# Altium project st7789 + esp32 + nrf24.PrjPcb
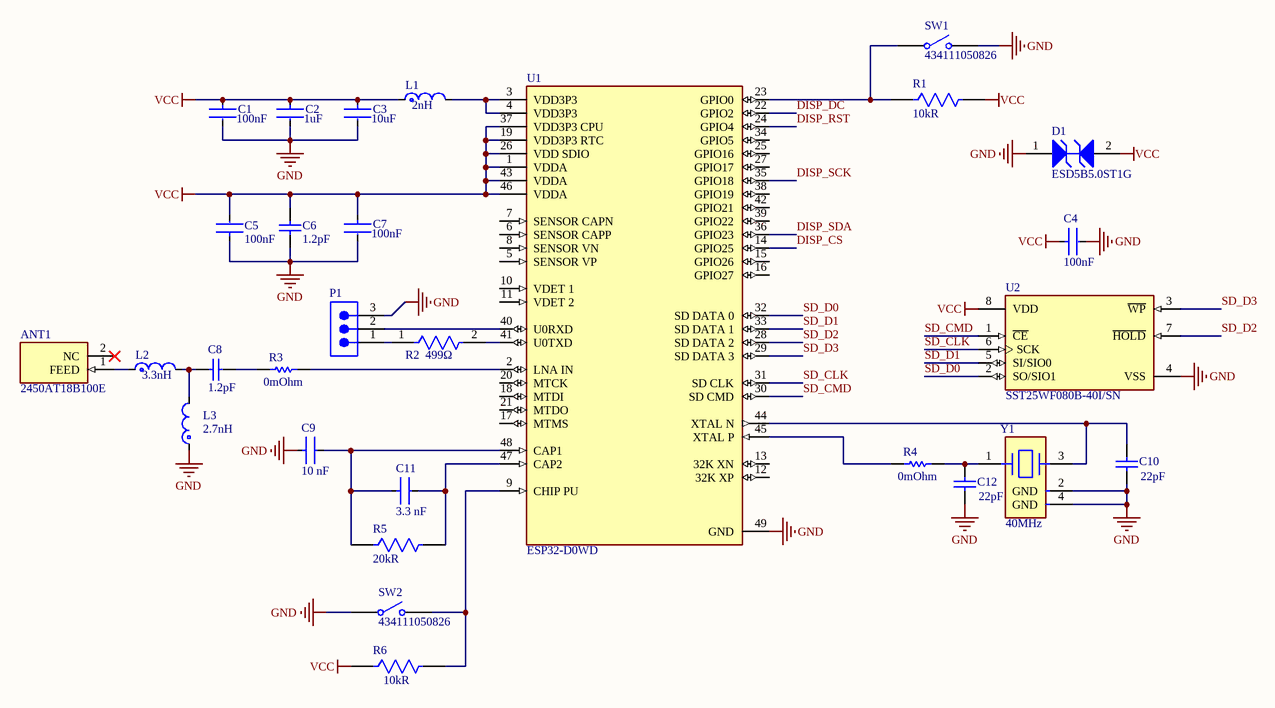
[diagram p0: esp32.SchDoc]
2 sheets, 56 parts. Net scope: global (net labels, ports and power ports of the same name join across sheets).
Board file: main.PcbDoc
Sheets:
  esp32.SchDoc
  power + display.SchDoc

## Sheet esp32.SchDoc
size A4; SheetNumber: 1; SheetTotal: 2

### Parts
ANT1  2450AT18B100E  [ANTC3216X140N]
C1  Capacitance: 100nF  [FP-CGA3E-0_3-0_1-IPC_A]  (hidden comment: CGA3E2X7R1H104K080AA)
C2  Capacitance: 1uF  [FP-0603-L_1_6_0_15-W_0_8-IPC_C]  (hidden comment: UMK107AB7105KA-T)
C3  Capacitance: 10uF  [FP-C1608-080-0_1-MFG]  (hidden comment: C1608X5R1A106K080AC)
C4  Capacitance: 100nF  [FP-CGA3E-0_3-0_1-IPC_A]  (hidden comment: CGA3E2X7R1H104K080AA)
C5  Capacitance: 100nF  [FP-CGA3E-0_3-0_1-IPC_A]  (hidden comment: CGA3E2X7R1H104K080AA)
C6  1.2pF  [CAPC1608X90X35NL10T15]
C7  Capacitance: 100nF  [FP-CGA3E-0_3-0_1-IPC_A]  (hidden comment: CGA3E2X7R1H104K080AA)
C8  1.2pF  [CAPC1608X90X35NL10T15]
C9  Capacitance: 10 nF  [FP-CC0603-DA-MFG]  (hidden comment: CC0603KRX7R9BB103)
C10  Capacitance: 22pF  [CAPC1608X90X35ML10T15]  (hidden comment: GRM1885C1H220JA01D)
C11  value 3.3 nF  [FP-C0603C-CF-MFG]  (hidden comment: C0603C332J5GACTU)
C12  Capacitance: 22pF  [CAPC1608X90X35ML10T15]  (hidden comment: GRM1885C1H220JA01D)
D1  ESD5B5.0ST1G  [ONSC-SOD-523-2-502-01_C_V]
L1  Inductance: 2nH  [FP-LQP03TG_02-IPC_A]  (hidden comment: LQP03TN2N0B02D)
L2  Inductance: 3.3nH  [FP-LQG18HH_00-MFG]  (hidden comment: LQG18HN3N3S00D)
L3  Inductance: 2.7nH  [FP-LQG18HH_00-MFG]  (hidden comment: LQG18HN2N7S00D)
P1  61900319521  [61900319521]  (value not drawn)
R1  Resistance: 10kR  [FP-RC0603-0_55-IPC_C]  (hidden comment: RC0603FR-0710KL)
R2  Resistance: 499Ω  [FP-RT0603-MFG]  (hidden comment: RT0603DRE07499RL)
R3  Resistance: 0mOhm  [RESC1608X55X25ML10T15]  (hidden comment: RC0603JR-070RL)
R4  Resistance: 0mOhm  [RESC1608X55X25ML10T15]  (hidden comment: RC0603JR-070RL)
R5  Resistance: 20kR  [FP-RC0603-0_55-IPC_C]  (hidden comment: RC0603FR-0720KL)
R6  Resistance: 10kR  [FP-RC0603-0_55-IPC_C]  (hidden comment: RC0603FR-0710KL)
SW1  434111050826  [WS-TASV_L6W3.5H5_4341x10508x6]
SW2  434111050826  [WS-TASV_L6W3.5H5_4341x10508x6]
U1  ESP32-D0WD  [FP-ESP32-D0WD-IPC_C]
U2  SST25WF080B-40I/SN  [FP-C04-057-SN-MFG]
Y1  Frequency: 40MHz  [FP-7M-MFG]  (hidden comment: 7M-40.000MEEQ-T)

### Nets
GND: C1.2 C2.2 C3.1 C4.2 C5.1 C6.1 C7.2 C9.1 C10.1 C12.1 D1.1(A1) L3.1 P1.3 SW1.2 SW2.1 U1.49(GND) U2.4(VSS) Y1.2(GND) Y1.4(GND)
VCC: C1.1 C2.1 C3.2 C4.1 C5.2 C6.2 C7.1 D1.2(A2) L1.1 R1.2 R6.1 U1.1(VDDA) U1.19(VDD3P3_RTC) U1.26(VDD_SDIO) U1.37(VDD3P3_CPU) U1.43(VDDA) U1.46(VDDA) U2.8(VDD)
DISP_CS: U1.14(GPIO25)
DISP_DC: U1.22(GPIO2)
DISP_RST: U1.24(GPIO4)
DISP_SCK: U1.35(GPIO18)
DISP_SDA: U1.36(GPIO23)
SD_CLK: U1.31(SD_CLK) U2.6(SCK)
SD_CMD: U1.30(SD_CMD) U2.1(~{CE})
SD_D0: U1.32(SD_DATA_0) U2.2(SO/SIO1)
SD_D1: U1.33(SD_DATA_1) U2.5(SI/SIO0)
SD_D2: U1.28(SD_DATA_2) U2.7(~{HOLD})
SD_D3: U1.29(SD_DATA_3) U2.3(~{WP})
NetANT1_1: ANT1.1(FEED) L2.1
NetC8_1: C8.1 L2.2 L3.2
NetC8_2: C8.2 R3.1
NetC9_2: C9.2 C11.1 R5.1 U1.48(CAP1)
NetC10_2: C10.2 U1.44(XTAL_N) Y1.3
NetC11_2: C11.2 R5.2 U1.47(CAP2)
NetC12_2: C12.2 R4.2 Y1.1
NetL1_2: L1.2 U1.3(VDD3P3) U1.4(VDD3P3)
NetP1_1: P1.1 R2.1
NetP1_2: P1.2 U1.40(U0RXD)
NetR1_1: R1.1 SW1.1 U1.23(GPIO0)
NetR2_2: R2.2 U1.41(U0TXD)
NetR3_2: R3.2 U1.2(LNA_IN)
NetR4_1: R4.1 U1.45(XTAL_P)
NetR6_2: R6.2 SW2.2 U1.9(CHIP_PU)

Not connected (* = marked no-connect by the designer): ANT1 2(NC)*; U1 5(SENSOR_VP) 6(SENSOR_CAPP) 7(SENSOR_CAPN) 8(SENSOR_VN) 10(VDET_1) 11(VDET_2) 12(32K_XP) 13(32K_XN) 15(GPIO26) 16(GPIO27) 17(MTMS) 18(MTDI) 20(MTCK) 21(MTDO) 25(GPIO16) 27(GPIO17) 34(GPIO5) 38(GPIO19) 39(GPIO22) 42(GPIO21)

### Library data of the parts
ANT1 = 2450AT18B100E: Antenna Chip -0.5dBi Gain 2500MHz 2-Pin CSMD T/R; MF: Johanson; SnapEDA_Link: https://www.snapeda.com/parts/2450AT18B100E/AN/view-part/?ref=snap; Package: None; Value: *; MP: 2450AT18B100E; Check_prices: https://www.snapeda.com/parts/2450AT18B100E/AN/view-part/?ref=eda
C1 C4 C5 C7 = CMP-2000-07546-2: Cap Ceramic 100nF 50V X7R 10% Pad SMD 0603 +125°C Automotive T/R; Weight: 7.1E-05oz; Composition: Ceramic; Max Operating Temperature: 125°C; Termination: SMD/SMT; Dielectric: X7R; Length: 1.6mm; Package Quantity: 1; REACH SVHC: No SVHC; Lead Free: Lead Free; Case Code (Metric): 1608; Min Operating Temperature: -55°C; Packaging: Tape and Reel; Tolerance: 10%; Voltage Rating: 50V; Case Code (Imperial): 0603; Case/Package: 0603; Voltage Rating (DC): 50V; Depth: 0.8mm; Radiation Hardening: No; Ratings: AEC-Q200; Mount: Surface Mount; Voltage: 50V; Thickness: 0.035inch; Width: 0.8mm; Height: 0.8mm
C2 = CMP-2000-07531-4: Ceramic Capacitor General Use 1uF ±10% 50V X7R 0603; Series: M; Width: 0.031inch; Mount: Surface Mount; Radiation Hardening: No; Voltage Rating (DC): 50V; Packaging: Tape and Reel; Termination: SMD/SMT; Depth: 0.8mm; Case Code (Metric): 1608; Case Code (Imperial): 0603; Height: 0.8mm; Voltage Rating: 50V; Package Quantity: 1; Halogen Free: Halogen Free; Dielectric: X7R; Min Operating Temperature: -55°C; Length: 1.6mm; Construction: Flat; Tolerance: 10%; Thickness: 0.037inch; Max Operating Temperature: 125°C; Case/Package: 0603; RoHS Compliant: Yes
C3 = CMP-2000-04979-3: Multilayer Ceramic Capacitors 10μF ±10% 10V X5R SMD 0603; Dielectric Material: Ceramic; Construction: Flat; Height: 0.8mm; Thickness: 0.035inch; Case Code (Metric): 1608; Radiation Hardening: No; Number of Pins: 2; Voltage Rating (DC): 10V; Depth: 0.8mm; Voltage: 10V; RoHS Compliant: Yes; Voltage Rating: 10V; Package Quantity: 1; Resistor Type: Ceramic; Termination: SMD/SMT; Lead Free: Lead Free; REACH SVHC: No SVHC; Tolerance: 10%; Mount: Surface Mount; Series: C; Packaging: Tape and Reel; Width: 0.8mm; Dielectric: X5R; Weight: 7.1E-05oz; Length: 1.6mm; Max Operating Temperature: 85°C; Case Code (Imperial): 0603; Case/Package: 0603; Min Operating Temperature: -55°C
C6 C8 = CMP-2006-02438-1: Manufacturer: Murata; Part Number: GQM1885C2A1R2CB01D
C9 = CMP-2100-03600-2: CAP CER 10000PF 50V X7R 0603; Manufacturer: YAGEO; Tolerance: 0.1; Material: Ceramic; Temperature Coefficient: 15%; Value: 10 nF; Mouser Description: Multilayer Ceramic Capacitor, CC Series, 0.01 - F, - 10%, X7R, 50 V, 0603 [1608 Metric]; Digikey Description: CAP CER 10000PF 50V X7R 0603; Height: 0.9mm; Category: Cap; Temperature Characteristic: X7R; Footprint Url: http://www.yageo.com/exep/pages/download/literatures/UPY-C_GEN_24.pdf; Lead Free: Yes; Voltage Rating: 50 V; Manufacturer Part Number: CC0603KRX7R9BB103; Temperature: -55°C to +125°C; Device Class L3: Ceramic Capacitors; ComponentLink2Description: Datasheet; Voltage: 50 V; Package: CC0603-DA; Octopart: https://octopart.com/cc0603krx7r9bb103-yageo-192938; Automotive: No; Temperature Range High: +125°C; Temperature Range Low: -55°C; RoHS: TRUE; Device Class L1: Passive Components; ComponentLink2URL: http://www.yageo.com/documents/recent/UPY-GPHC_X7R_6.3V-to-50V_18.pdf; Device Class L2: Capacitors
C10 C12 = CMP-2000-04945-1: Chip Capacitor, 22 pF, +/- 5%, 50 V, -55 to 125 degC, 0603 (1608 Metric), RoHS, Tape and Reel; Manufacturer: Murata; Rated Voltage: 50V; Dielectric: C0G; Manufacturer URL: http://www.murata.com/; Datasheet Version: Jul-06; Package Reference: 603; Tolerance (%): ±5%; Case Size/Dimension: 0603; Package Description: 2-Pin Surface Mount Device, Body 1.6 x 0.8 mm; Datasheet URL: https://datasheet.ciiva.com/11786/0900766b807a1cab-11786398.pdf
C11 = CMP-2006-03334-2: CAP CER 3300PF 50V 5% NP0 0603; Manufacturer: KEMET; Temperature Characteristic: C0G; Temperature Coefficient: 30ppm/°C; Tolerance: 0.05; Automotive Grade: Grade 1; Material: Ceramic; Capacitance: 3,300 pF; Category: Cap; Digikey Description: CAP CER 3300PF 50V 5% NP0 0603; Temperature Range Low: -55°C; Mouser Description: Multilayer Ceramic Capacitors MLCC - SMD/SMT 50volts 3300pF 5% C0G; Device Class L2: Capacitors; Octopart: https://octopart.com/c0603c332j5gactu-kemet-12580539; Package: C0603C-CF; Lead Free: Yes; Temperature Range High: +125°C; Automotive: Yes; ComponentLink2URL: https://api.kemet.com/component-edge/download/datasheet/C0603C100J5GACAUTO.pdf; Voltage Rating: 50 V; Device Class L3: Ceramic Capacitors; Temperature: -55°C to +125°C; ComponentLink2Description: Datasheet; Device Class L1: Passive Components; Manufacturer Part Number: C0603C332J5GACTU; Height: 0.87mm; RoHS: TRUE
D1 = CMP-1063-00096-1: Transient Voltage Suppressor, Micro-Packaged Diode for ESD Protection, 2-Pin SOD-523, Pb-Free, Tape and Reel; Manufacturer: On Semiconductor; Number of Lines: 1; Direction: Bidirectional; VRWM Max (V): 5; V(BR) Min (V): 5.8; ComponentLink2URL: http://www.onsemi.cn/pub_link/Collateral/ESD5B5.0ST1G.PDF; Mounting Technology: Surface Mount; ComponentLink1URL: http://www.onsemi.com/; ComponentLink2Description: Datasheet; ComponentLink3Description: Package Specification; RoHS: Pb-Free; Packing: Tape and Reel; PackageDescription: 2-Pin SOD, Body 1.2 x 0.8 mm; ComponentLink1Description: Manufacturer URL; ComponentLink3URL: http://www.onsemi.cn/pub_link/Collateral/ESD5B5.0ST1G.PDF; PackageVersion: Rev. C, 03/2007; DatasheetVersion: Rev. 3; PartNumber: ESD5B5.0ST1G; PackageReference: SOD-523-2-502-01_C; IR Max (uA): 1
L1 = CMP-06042-013297-1: Film type RF Inductor 2nH ±0.1nH 600mA 0.15Ω 0201 (0603); Current: 400mA; DC Resistance (DCR): 150mR; Core Material: Non-Magnetic; Q Factor: 14; Shielding: Unshielded; Self Resonant Frequency: 12.5GHz; Test Frequency: 500MHz; Height - Seated (Max): 0.013inch; Case/Package: 0201; Depth: 0.33mm; Width: 0.012inch; Mount: Surface Mount; Case Code (Imperial): 0201; Packaging: Tape and Reel; Max DC Current: 600mA; Resistor Type: Thin Film; Case Code (Metric): 0603; Length: 0.6mm; Termination: SMD/SMT; Max Operating Temperature: 125°C; REACH SVHC: No SVHC; DC Current: 600mA; Package Quantity: 15000; Height: 0.3mm; Military Standard: Not; Min Operating Temperature: -55°C; Current Rating: 600mA
L2 = CMP-06042-009861-1: Multilayer type RF Inductor 3.3nH ±0.3nH 0.12Ω 1000mA 0603; Max DC Current: 500mA; Q Factor: 12; DC Resistance (DCR): 150mR; Test Frequency: 100MHz; Self Resonant Frequency: 6GHz; Shielding: Unshielded; Core Material: Air; Case/Package: 0603; DC Current: 500mA; Case Code (Metric): 1608; Package Quantity: 4000; Depth: 0.95mm; Max Operating Temperature: 85°C; Height - Seated (Max): 0.037inch; Mount: Surface Mount; REACH SVHC: No SVHC; Length: 1.6mm; Min Operating Temperature: -55°C; Military Standard: Not; Lead Free: Lead Free; Width: 0.8mm; Packaging: Tape and Reel; Height: 0.8mm; Termination: SMD/SMT; Current Rating: 500mA; Case Code (Imperial): 0603; Radiation Hardening: No
L3 = CMP-06042-013926-1: Multilayer type RF Inductor 2.7nH ±0.3nH 0.12Ω 1000mA 0603; Current Rating: 500mA; DC Resistance (DCR): 150mR; Q Factor: 12; Self Resonant Frequency: 6GHz; Test Frequency: 100MHz; Shielding: Unshielded; Core Material: Air; Mount: Surface Mount; Lead Free: Lead Free; Length: 1.75mm; Case Code (Imperial): 0603; Military Standard: Not; Case Code (Metric): 1608; Max DC Current: 500mA; Min Operating Temperature: -55°C; Depth: 0.95mm; REACH SVHC: No SVHC; Termination: SMD/SMT; Package Quantity: 4000; Number of Pins: 2; Max Operating Temperature: 85°C; Height: 0.8mm; Case/Package: 0603; Width: 0.8mm; Packaging: Tape and Reel; Height - Seated (Max): 0.037inch; DC Current: 500mA; Radiation Hardening: No
P1 = CMP-1502-00600-2: NexarPartId: 18818224; Connector Type: Male Pin; Contact Resistance: 20mΩ; Pitch: 2.54mm; Insulation Resistance: 1GΩ; Number of Contacts: 3; Insulation: Insulated; Gender: Male; Operating Supply Voltage: 250V; Current Rating: 3A; Number of Pins: 3; Min Operating Temperature: -40°C; Color: Beige; Contact Gender: Male; RoHS: Compliant; Max Operating Temperature: 105°C; Height: 3.3mm; Length: 7.62mm; Packaging: Bulk; Width: 7.62mm; Contact Plating: Tin; Lead Pitch: 2.54mm; Number of Rows: 1; Lead Free: Lead Free; Mount: Through Hole; Termination: Through Hole; REACH SVHC: Unknown; Number of Positions: 3; Contact Material: Copper; Contact Mating Length: 7.493mm; Flammability Rating: UL94 V-0; Housing Material: Nylon; Voltage Rating: 250V; Fastening Type: Friction
R1 R6 = CMP-2100-03664-2: RES 10K OHM 1% 1/10W 0603; Voltage Rating: 75V; Voltage Rating (DC): 50V; Power Rating: 100mW; Temperature Coefficient: 100ppm/°C; Depth: 0.8mm; Termination: SMD/SMT; Resistor Type: Thick Film; Series: RC; Construction: Rectangular; Features: Moisture Resistant; Packaging: Tape and Reel; Min Operating Temperature: -55°C; Number of Terminations: 2; Lead Pitch: 0.3mm; RoHS Compliant: Yes; Case/Package: 0603; Resistance Tolerance: 1%; Military Standard: Not; Weight: 7.1E-05oz; Number of Pins: 2; Tolerance: 1%; Length: 1.6mm; Case Code (Imperial): 0603; Lead Free: Lead Free; Width: 0.8mm; Max Power Dissipation: 100mW; Height: 0.45mm; Max Operating Temperature: 155°C; Case Code (Metric): 1608; Size Code: 0603
R2 = CMP-03412-013051-1: RES 499 OHM 1/10W .5% SMD 0603; Manufacturer: Yageo; Tolerance: 0.005; Temperature Coefficient: 50 ppm/°C; Voltage Rating: 75V; Power Rating: 0.1W; Value: 499Ω; Temperature Range High: +155°C; ComponentLink2URL: http://www.yageo.com/documents/recent/PYu-RT_1-to-0.01_RoHS_L_9.pdf; Device Class L3: Chip SMD Resistors; Digikey Description: RES 499 OHM 1/10W .5% SMD 0603; Height: 0.55mm; Category: Res; Temperature Range Low: -55°C; Manufacturer Part Number: RT0603DRE07499RL; Footprint Url: http://www.yageo.com/exep/pages/download/literatures/PYu-R_Mount_10.pdf; Device Class L1: Passive Components; Temperature: -55°C to +155°C; ComponentLink2Description: Datasheet; Ipc Land Pattern Name: RESC16080X45; RoHS: TRUE; Composition: Thin Film; Package: RT0603; Lead Free: Yes; Device Class L2: Resistors; Automotive: No; Octopart: https://octopart.com/rt0603dre07499rl-yageo-1226881; Series: RT
R3 R4 = CMP-2100-03667-1: Chip Resistor, 0 Ohm, +/- 5%, 0.1 W, -55 to 155 degC, 0603 (1608 Metric), RoHS, Tape and Reel; Manufacturer: Yageo; Temperature Coefficient: 200ppm/degreesC; Voltage Rating: 50V; Power Rating: 100mW; Width: 0.8mm; Max Operating Temperature: 155degC; Tolerance: 5%; Package Reference: 0603; Height: 0.45mm; Depth: 0.8mm; Package Description: 2-Pin Surface Mount Device, Body 1.6 x 0.8 mm; Termination: SMD/SMT; Package Quantity: 5000; Case/Package: 0603; Case Code (Imperial): 0603; Radiation Hardening: No; Number of Pins: 2; Length: 1.6mm; Lead Free: LeadFree; Voltage Rating (DC): 50V; Military Standard: Not; Datasheet URL: http://www.yageo.com/NewPortal/yageodocoutput?fileName=/pdf/R-Chip/PYu-RC_Group_51_RoHS_L_5.pdf; Manufacturer URL: http://www.yageo.com/; Packaging: TapeandReel; Case Code (Metric): 1608; Min Operating Temperature: -55degC; Composition: ThickFilm; RoHSCompliant: true; Contact Plating: Tin; Datasheet Version: Rev. 5, 10/2016; REACH SVHC: NoSVHC
R5 = CMP-2000-06932-2: RES 20K OHM 1% 1/10W 0603; Voltage Rating: 50V; Temperature Coefficient: 100ppm/°C; Power Rating: 100mW; Height: 0.022inch; REACH SVHC: No SVHC; Case Code (Metric): 1608; Depth: 0.8mm; Tolerance: 1%; Min Operating Temperature: -55°C; Series: RC; RoHS Compliant: Yes; Resistor Type: Thick Film; Max Power Dissipation: 100mW; Features: Moisture Resistant; Max Operating Temperature: 155°C; Package Quantity: 1; Size Code: 0603; Packaging: Tape and Reel; Width: 0.031inch; Length: 0.063inch; Military Standard: Not; Technology: THICK FILM; Number of Terminations: 2; Termination: SMD/SMT; Construction: Rectangular; Case/Package: 0603; Number of Pins: 2; Lead Free: Lead Free; Voltage Rating (DC): 50V; Resistance Tolerance: 1%; Case Code (Imperial): 0603
SW1 SW2 = CMP-1459-00003-2: NexarPartId: 23272333; Throw Configuration: SPST; Illumination Type: Illuminated, Non-Illuminated; Voltage Rating: 12V; Switch Travel: 250µm; Switch Function: Off-Mom; Mechanical Life: 30kcycles; Operating Force: 260N; Contact Current Rating: 50mA; Actuator Material: Liquid Crystal Polymer, Polymer; Contact Resistance: 100mΩ; Actuator Length: 1.5mm; Termination: SMD/SMT; Contact Material: Stainless Steel, Steel; Max Operating Temperature: 85°C; REACH SVHC: No SVHC; Length: 8mm; Packaging: Tape and Reel; Min Operating Temperature: -40°C; RoHS: Compliant; Width: 3.5mm; Mount: Surface Mount; Current Rating: 50mA; Contact Plating: Silver; Height: 5mm; Insulation Resistance: 100MΩ
U1 = CMP-194065-000002-1: IC RF TXRX+MCU BLUETOOTH 48VFQFN; Manufacturer: Espressif; Max Frequency: 2484MHz; Max Supply Voltage: 3.6V; Interface: I2C,SPI,UART,CAN,Ethernet,I2S,Other; Receiving Current: 100mA; Min Supply Voltage: 1.8V; Data Rate: 150Mbits/s; Number Of Gpio: 34; Bandwidth: 2412-2484MHz; Nominal Supply Current: 0.5A; Sensitivity: -70dBm; Number Of Adc Channels: 18; Transmitting Current: 240mA; Standoff Height: 0mm; Manufacturer Part Number: ESP32-D0WD; Device Class L3: Transceivers; Ipc Land Pattern Name: QFN35P500X500X85-48; Category: IC; Device Class L2: RF Semiconductors and Devices; Device Class L1: Integrated Circuits (ICs); Digikey Description: IC RF TXRX+MCU BLUETOOTH 48VFQFN; ComponentLink2URL: https://www.espressif.com/sites/default/files/documentation/esp32_datasheet_en.pdf; Temperature Range Low: -40°C; Mouser Description: SMD IC ESP32-D0WD, Dual Core Mcu, Wifi & Bluetooth Combo, QFN48-PIN, 5*5MM; Height: 0.9mm; Octopart: https://octopart.com/esp32-d0wd-espressif+systems-89169964; Automotive: No; ComponentLink2Description: Datasheet; Temperature: -40°C to +125°C; Lead Free: Yes; Temperature Range High: +125°C; RoHS: TRUE; Package: ESP32-D0WD
U2 = CMP-06315-000020-1: IC FLASH 8MBIT SPI 40MHZ 8SOIC; Min Supply Voltage: 1.65V; Nominal Supply Current: 4mA; Density: 8Mb; Page Size: 256B; Operating Supply Voltage: 1.8V; Max Supply Voltage: 1.95V; Min Operating Temperature: -40°C; Frequency: 40MHz; Mount: Surface Mount; Memory Type: FLASH; Packaging: Rail/Tube; Interface: SPI; Memory Size: 8Mb; Max Operating Temperature: 85°C; Number of Pins: 8; Case/Package: SOIC; Supply Current: 4mA; Height: 1.5mm; RoHS Compliant: Yes; Series: SST25; REACH SVHC: No SVHC; Contact Plating: Tin; Radiation Hardening: No; Max Frequency: 40MHz; Length: 4.9mm; Width: 3.9mm
Y1 = CMP-18717-000452-1: Crystal 40MHz, 10ppm, 10pF, 50Ω; ESR (Equivalent Series Resistance): 60R; Lead Free: Lead Free; Frequency Tolerance: 10ppm; Width: 2.5mm; Depth: 2.5mm; Frequency Stability: 10ppm; Length: 0.126inch; Height: 0.031inch; Max Operating Temperature: 70°C; Load Capacitance: 10pF; Packaging: Tape and Reel; Series: 7M; Min Operating Temperature: -10°C; Mount: Surface Mount; Package Quantity: 1; REACH SVHC: No SVHC; Termination: SMD/SMT; Case/Package: SMD/SMT; Tolerance: 10ppm

## Sheet power + display.SchDoc
size A4; SheetNumber: 2; SheetTotal: 2
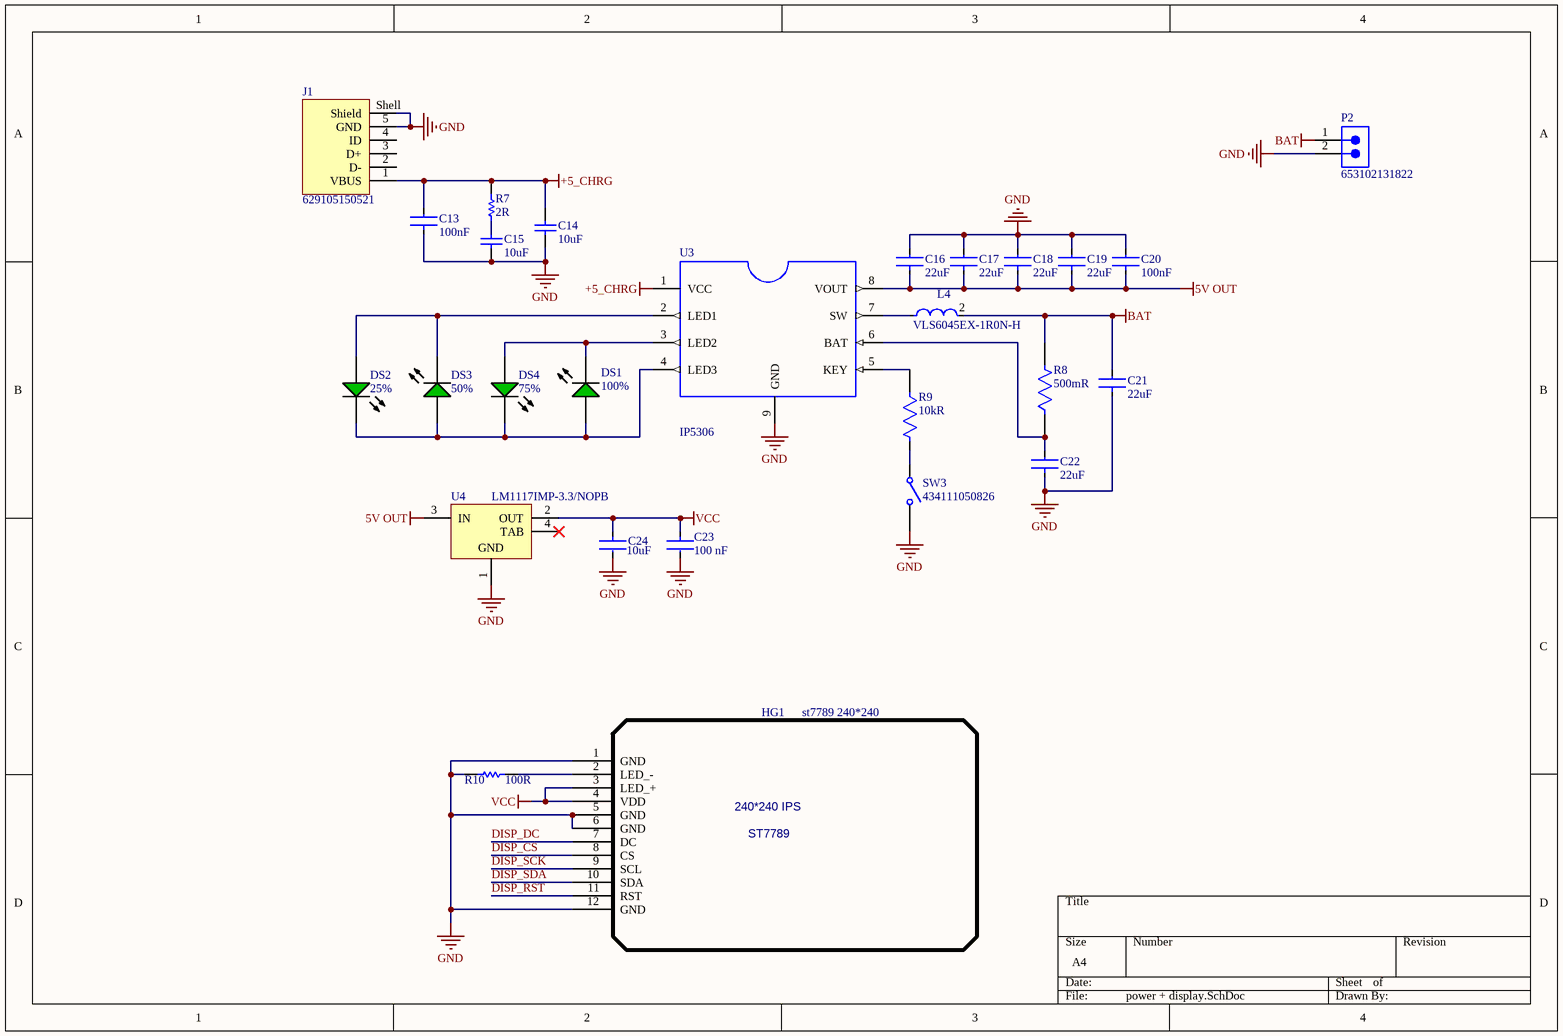
[diagram p1: power + display.SchDoc]

### Parts
C13  Capacitance: 100nF  [FP-CGA3E-0_3-0_1-IPC_A]  (hidden comment: CGA3E2X7R1H104K080AA)
C14  10uF  [CAPC2013X140X45NL15T25]
C15  10uF  [CAPC2013X140X45NL15T25]
C16  Capacitance: 22uF  [FP-1206-L_3_2_0_2-W_1_6_0-IPC_A]  (hidden comment: 12066C226KAT2A)
C17  Capacitance: 22uF  [FP-1206-L_3_2_0_2-W_1_6_0-IPC_A]  (hidden comment: 12066C226KAT2A)
C18  Capacitance: 22uF  [FP-1206-L_3_2_0_2-W_1_6_0-IPC_A]  (hidden comment: 12066C226KAT2A)
C19  Capacitance: 22uF  [FP-1206-L_3_2_0_2-W_1_6_0-IPC_A]  (hidden comment: 12066C226KAT2A)
C20  Capacitance: 100nF  [FP-CGA3E-0_3-0_1-IPC_A]  (hidden comment: CGA3E2X7R1H104K080AA)
C21  Capacitance: 22uF  [FP-1206-L_3_2_0_2-W_1_6_0-IPC_A]  (hidden comment: 12066C226KAT2A)
C22  Capacitance: 22uF  [FP-1206-L_3_2_0_2-W_1_6_0-IPC_A]  (hidden comment: 12066C226KAT2A)
C23  value 100 nF  [FP-CC0402-MFG]  (hidden comment: CC0402KRX7R9BB104)
C24  Capacitance: 10uF  [FP-C1608-080-0_1-MFG]  (hidden comment: C1608X5R1A106K080AC)
DS1  100%  [AVAG-HSMX-C170_V]
DS2  25%  [AVAG-HSMX-C170_V]
DS3  50%  [AVAG-HSMX-C170_V]
DS4  75%  [AVAG-HSMX-C170_V]
HG1  st7789 240*240  [PCBComponent_1]
J1  629105150521  [629105150521]
L4  VLS6045EX-1R0N-H  [FP-VLS6045EX-H-MFG]
P2  653102131822  [653102131822]
R7  2R  [RESC2013X60X30ML20T20]
R8  500mR  [FP-CSR0603-IPC_B]
R9  Resistance: 10kR  [FP-MCT0603-IPC_C]  (hidden comment: MCT06030C1002FP500)
R10  100R  [RESC1609X50X30LL10T20]
SW3  434111050826  [WS-TASV_L6W3.5H5_4341x10508x6]
U3  IP5306  [SOIC9P127_490X600X170L84X42T330X241N]
U4  LM1117IMP-3.3/NOPB  [DCY0004A_N]

### Nets
5V OUT: C16.1 C17.1 C18.1 C19.1 C20.1 U3.8(VOUT) U4.3(IN)
+5_CHRG: C13.2 C14.2 J1.1(VBUS) R7.2 U3.1(VCC)
BAT: C21.2 L4.2 P2.1 R8.2
GND: C13.1 C14.1 C15.1 C16.2 C17.2 C18.2 C19.2 C20.2 C21.1 C22.1 C23.2 C24.1 HG1.1(GND) HG1.5(GND) HG1.6(GND) HG1.12(GND) J1.5(GND) J1.Shell(Shield) P2.2 R10.1 SW3.2 U3.9(GND) U4.1(GND)
VCC: C23.1 C24.2 HG1.3(LED_+) HG1.4(VDD) U4.2(OUT)
DISP_CS: HG1.8(CS)
DISP_DC: HG1.7(DC)
DISP_RST: HG1.11(RST)
DISP_SCK: HG1.9(SCL)
DISP_SDA: HG1.10(SDA)
NetC15_2: C15.2 R7.1
NetC22_2: C22.2 R8.1 U3.6(BAT)
NetDS1_1: DS1.1(A) DS2.2(K) DS3.1(A) DS4.2(K) U3.4(LED3)
NetDS1_2: DS1.2(K) DS4.1(A) U3.3(LED2)
NetDS2_1: DS2.1(A) DS3.2(K) U3.2(LED1)
NetHG1_2: HG1.2(LED_-) R10.2
NetL4_1: L4.1 U3.7(SW)
NetR9_1: R9.1 U3.5(KEY)
NetR9_2: R9.2 SW3.1

Not connected (* = marked no-connect by the designer): J1 2(D-) 3(D+) 4(ID); U4 4(TAB)*

### Notes on the sheet
- (in symbol st7789 240*240) 240*240 IPS; ST7789

### Library data of the parts
C13 C20 = CMP-2000-07546-2: as C1 on sheet esp32; Weight: 7.1E-05oz; Composition: Ceramic; Max Operating Temperature: 125°C; Termination: SMD/SMT; Dielectric: X7R; Length: 1.6mm; Package Quantity: 1; REACH SVHC: No SVHC; Lead Free: Lead Free; Case Code (Metric): 1608; Min Operating Temperature: -55°C; Packaging: Tape and Reel; Tolerance: 10%; Voltage Rating: 50V; Case Code (Imperial): 0603; Case/Package: 0603; Voltage Rating (DC): 50V; Depth: 0.8mm; Radiation Hardening: No; Ratings: AEC-Q200; Mount: Surface Mount; Voltage: 50V; Thickness: 0.035inch; Width: 0.8mm; Height: 0.8mm
C14 C15 = CMP-2007-03395-1: Part Number: GRM21BR71A106KE51L; Manufacturer: Murata
C16-C19 C21 C22 = CMP-1037-04985-3: CAP CER 22UF 6.3V X7R 1206; Tolerance: 10%; Dissipation Factor: 5%; Thickness: 0.07inch; Min Operating Temperature: -55°C; Width: 1.6mm; Case Code (Metric): 3216; Construction: Flat; Max Operating Temperature: 125°C; Case/Package: 1206; Case Code (Imperial): 1206; Lead Free: Lead Free; REACH SVHC: No SVHC; Voltage Rating (DC): 6.3V; Number of Pins: 2; Contact Plating: Tin; Dielectric: X7R; Radiation Hardening: No; Depth: 1.6mm; Series: FlEXITERM; Mount: Surface Mount; Voltage Rating: 6.3V; Package Quantity: 2500; RoHS Compliant: Yes; Length: 3.2mm; Height: 1.78mm; Voltage: 6.3V; Termination: SMD/SMT; Packaging: Tape and Reel
C23 = CMP-03422-001010-1: CAP CER 0.1UF 50V X7R 0402; Manufacturer: YAGEO; Temperature Coefficient: 30ppm/°C; Material: Ceramic; Automotive Grade: NA; Tolerance: 0.1; Footprint Url: http://www.yageo.com/exep/pages/download/literatures/UPY-C_GEN_24.pdf; Category: Cap; Capacitance: 100 nF; Package: CC0402; Voltage Rating: 50 V; ComponentLink2Description: Datasheet; Temperature Characteristic: X7R; Device Class L1: Passive Components; Device Class L2: Capacitors; Digikey Description: CAP CER 0.1UF 50V X7R 0402; Octopart: https://octopart.com/cc0402krx7r9bb104-yageo-56536067; Device Class L3: Ceramic Capacitors; Height: 0.55mm; Temperature: -55°C to +125°C; Temperature Range High: +125°C; ComponentLink2URL: http://www.yageo.com/documents/recent/UPY-GP_NP0_16V-to-50V_16.pdf; Temperature Range Low: -55°C; RoHS: TRUE; Ipc Land Pattern Name: CAPC10050X50; Lead Free: Yes; Automotive: No; Manufacturer Part Number: CC0402KRX7R9BB104
C24 = CMP-2000-04979-3: as C3 on sheet esp32; Dielectric Material: Ceramic; Construction: Flat; Height: 0.8mm; Thickness: 0.035inch; Case Code (Metric): 1608; Radiation Hardening: No; Number of Pins: 2; Voltage Rating (DC): 10V; Depth: 0.8mm; Voltage: 10V; RoHS Compliant: Yes; Voltage Rating: 10V; Package Quantity: 1; Resistor Type: Ceramic; Termination: SMD/SMT; Lead Free: Lead Free; REACH SVHC: No SVHC; Tolerance: 10%; Mount: Surface Mount; Series: C; Packaging: Tape and Reel; Width: 0.8mm; Dielectric: X5R; Weight: 7.1E-05oz; Length: 1.6mm; Max Operating Temperature: 85°C; Case Code (Imperial): 0603; Case/Package: 0603; Min Operating Temperature: -55°C
DS1-DS4 = CMP-2000-05062-1: Chip LED, Green, 2.2 V, -40 to 85 degC, 2-Pin SMD, Pb-Free, Tape and Reel; Manufacturer: Avago; No. of Pins: 2; Peak Wavelength: 570nm; SVHC: NoSVHC(16-Jun-2014); Dominant Wavelength: 572nm; Forward Current If: 20mA; Viewing Angle: 170deg; Lens Shape: Rectangular; PIV Max: 5V; External Width: 1.25mm; LED Type: Standard; External Depth: 0.8mm; Opto Mounting Orientation: Top; Luminous Intensity: 15mcd; Luminous Intensity Min: 4mcd; Forward Voltage VF Max: 2.6V; External Length / Height: 2mm; Bulb Size: 1.25mmx1.4mm; Light Area Height: 1mm; Voltage Vf Typ: 2.2V; Operating Temperature Max: 85degC; Datasheet Version: Oct-08; MSL: MSL2A-4weeks; Peak Forward Current: 20mA; Package Description: 2-Pin Surface Mount Device, Body 2 x 1.25 mm, Height 0.8 mm; Datasheet URL: https://datasheet.ciiva.com/29280/180495-da-01-en-chip-led-hsmg-c170-gelb-gruen-29280971.pdf; Storage Temperature Min: -40degC; LED Colour: Green; Wavelength Typ: 570nm; Mounting Type: SMD; Forward Current If Max: 20mA; Dominant Wavelength Typ: 572nm; LED Mounting: SMD; Operating Temperature Range: -30degCto+85degC; Operating Temperature Min: -30degC; Manufacturer URL: http://www.avagotech.com/; Packaging: CutTape; Luminous Intensity Typ: 15mcd; Package Reference: HSMX-C170; Storage Temperature Max: 85degC; Opto Case Style: SMD; Forward Voltage: 2.2V
J1 = CMP-1502-03252-3: NexarPartId: 52645113; Number of Contacts: 5; Contact Resistance: 30mΩ; Connector Type: USB; Voltage Rating: 30V; Current Rating: 3A; USB Standard: USB 2.0; Gender: Receptacle; Insulation Resistance: 1GΩ; Height: 2.86mm; REACH SVHC: Unknown; RoHS: Compliant; Features: Shielded; Termination: SMD/SMT; Number of Pins: 5; Contact Plating: Gold; Packaging: Tape and Reel; Contact Material: Gold; Mount: Horizontal, Surface Mount; Max Operating Temperature: 85°C; Lead Free: Lead Free; Min Operating Temperature: -40°C; Orientation: Horizontal; Operating Supply Voltage: 30V
L4 = CMP-08253-000044-1: FIXED IND 1UH 6A 12MOHM SMD; RoHS Compliant: Yes
P2 = CMP-1502-00771-2: NexarPartId: 18818274; Number of Contacts: 2; Insulation Resistance: 100MΩ; Connector Type: Male Pin; Contact Resistance: 20mΩ; Voltage Rating: 125V; Current Rating: 1A; Gender: Male; Insulation: Insulated; Pitch: 1.25mm; Height: 4.2mm; Termination: SMD/SMT; Contact Material: Copper; Contact Plating: Tin; RoHS: Compliant; Number of Pins: 2; Length: 7.25mm; Housing Material: Nylon; Packaging: Tape and Reel; Lead Pitch: 1.25mm; Contact Mating Length: 2.1336mm; Mount: Surface Mount; Max Operating Temperature: 85°C; Contact Gender: Male; Number of Rows: 1; REACH SVHC: Unknown; Number of Positions: 2; Color: Beige, White; Operating Supply Voltage: 125V; Min Operating Temperature: -40°C; Width: 7.25mm; Flammability Rating: UL94 V-0
R7 = CMP-2001-02290-1: Part Number: RK73H2ATTD2R00F; Manufacturer: KOA Speer
R8 = CMP-26527-003904-1: General Purpose Thick Film Chip Resistor, 0603, 0.5Ω, 5%, 300ppm/°C, 0.125W; Min Operating Temperature: -55°C; Max Operating Temperature: 155°C; Packaging: Tape and Reel; Mount: Surface Mount; RoHS Compliant: Yes; Tolerance: 5%
R9 = CMP-02407-000418-1: RES SMD 100 OHM 1% 1/8W 0603; Voltage Rating: 75V; Power Rating: 100mW; Temperature Coefficient: 50ppm/°C; Max Power Dissipation: 125mW; Case/Package: 0603; Military Standard: Not; Min Operating Temperature: -55°C; Width: 0.8mm; Package Quantity: 1; Max Operating Temperature: 125°C; Tolerance: 1%; Depth: 0.85mm; Radiation Hardening: No; Mount: Surface Mount; Composition: Thin Film; Contact Plating: Tin; Lead Free: Lead Free; Case Code (Imperial): 0603; Number of Terminations: 2; Voltage Rating (DC): 75V; Length: 1.55mm; Packaging: Tape and Reel; Height: 0.022inch; Case Code (Metric): 1608
R10 = CMP-2000-03826-1: Manufacturer: Vishay Dale; Part Number: CRCW0603100RFKTA
SW3 = CMP-1459-00003-2: as SW1 on sheet esp32; Termination: SMD/SMT; Contact Material: Stainless Steel, Steel; Max Operating Temperature: 85°C; REACH SVHC: No SVHC; Length: 8mm; Packaging: Tape and Reel; Min Operating Temperature: -40°C; RoHS: Compliant; Width: 3.5mm; Mount: Surface Mount; Current Rating: 50mA; Contact Plating: Silver; Height: 5mm; Insulation Resistance: 100MΩ
U3 = IP5306: RC (Pi) EMI Filter 2nd Order Low Pass 2 Channel R = 2.2kOhms, C = 1700pF 8-UFBGA, WLCSP; MF: NXP USA Inc.; Value: *; Package: UFBGA-8 NXP Semiconductors; MP: IP5306; Price: None; SnapEDA_Link: https://www.snapeda.com/parts/IP5306/NXP%20Semiconductors/view-part/6618313/?ref=snap; Check_prices: https://www.snapeda.com/parts/IP5306/NXP%20Semiconductors/view-part/6618313/?ref=eda; Availability: Not in stock
U4 = CMP-0062-01631-4: 800mA Low-Dropout Linear Regulator, 4-pin SOT-223, Pb-Free; Manufacturer: Texas Instruments; PackageTopMarking: XYTT*N05B; PowerWise: N; High-Reliability: Y; CompType: LDO IC; Code_IPC: SOT223-4; PackageReference: DCY0004A; PinCount: 4; PackageDescription: Molded SOT-223, 6.50 x 3.56 x 1.6mm Body, 4 Lead, 2.3mm Pitch; PartNumber: LM1117IMP-3.3/NOPB; RoHS: Y; ComponentLink1Description: Datasheet URL; Code_JEDEC: TO-261-AA; ComponentLink1URL: http://www.ti.com/general/docs/lit/getliterature.tsp?genericPartNumber=LM1117-N&fileType=pdf

## Nets that join several sheets
GND: esp32 (19 pins), power + display (23 pins)
VCC: esp32 (18 pins), power + display (5 pins)
DISP_CS: esp32 (U1.14), power + display (HG1.8)
DISP_DC: esp32 (U1.22), power + display (HG1.7)
DISP_RST: esp32 (U1.24), power + display (HG1.11)
DISP_SCK: esp32 (U1.35), power + display (HG1.9)
DISP_SDA: esp32 (U1.36), power + display (HG1.10)